# Altium schematic sheet Auxilary.SchDoc: Board Level Annotation
size 431 x 279 mm; Organization: Altium Limited; Address1: L3, 12a Rodborough Rd; Address2: Frenchs Forest; Address3: NSW; Address4: Australia 2086; DocumentNumber: 1; SheetNumber: 1; SheetTotal: 8
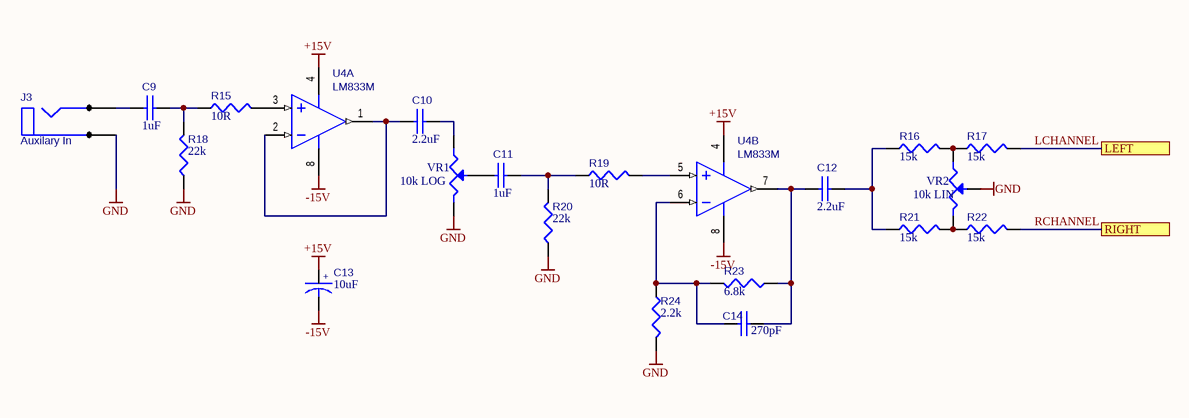
[diagram p0: Auxilary.SchDoc]

## Parts
C9  1uF  [RB.2/.4-NP]
C10  2.2uF  [RB.2/.4-NP]
C11  1uF  [RB.2/.4-NP]
C12  2.2uF  [RB.2/.4-NP]
C13  10uF  [RB.2/.4]
C14  270pF  [RAD0.2]
J3  Auxilary In  [JACK-6.25MM]
R15  10R  [AXIAL0.4]
R16  15k  [AXIAL0.4]
R17  15k  [AXIAL0.4]
R18  22k  [AXIAL0.4]
R19  10R  [AXIAL0.4]
R20  22k  [AXIAL0.4]
R21  15k  [AXIAL0.4]
R22  15k  [AXIAL0.4]
R23  6.8k  [AXIAL0.4]
R24  2.2k  [AXIAL0.4]
U4  LM833M  [DIP8]  (parts A,B of 2)
VR1  10k LOG  [POT - 24MM]
VR2  10k LIN  [POT - 24MM]

## Ports
LEFT, RIGHT

## Nets
+15V: C13.1 U4.4(V-)
-15V: C13.2 U4.8(V+)
GND: J3.3(C) R18.1 R20.1 R24.2 VR1.3 VR2.2(W)
LCHANNEL: R17.2 ; port LEFT
RCHANNEL: R22.2 ; port RIGHT
NetC9_1: C9.1 J3.1(A)
NetC9_2: C9.2 R15.1 R18.2
NetC10_1: C10.1 U4.1(OUT1) U4.2(IN1-)
NetC10_2: C10.2 VR1.1
NetC11_1: C11.1 VR1.2(W)
NetC11_2: C11.2 R19.1 R20.2
NetC12_1: C12.1 C14.2 R23.1 U4.7(OUT2)
NetC12_2: C12.2 R16.1 R21.1
NetC14_1: C14.1 R23.2 R24.1 U4.6(IN2-)
NetR15_2: R15.2 U4.3(IN1+)
NetR16_2: R16.2 R17.1 VR2.1
NetR19_2: R19.2 U4.5(IN2+)
NetR21_2: R21.2 R22.1 VR2.3

## Notes on the sheet
- 8
- 7
- 6
- 5
- 4
- 3
- DWG. NO.
- REV.
- SHT.
- 2
- 1
- THIS DOCUMENT AND THE DATA DISCLOSED HEREIN OR HEREWITH IS THE PROPERTY OF ALTIUM LIMITED AND MAY BE FREELY DISTRIBUTED IN WHOLE. NO RIGHTS ARE RESERVED OR EXPRESS OR IMPLIED WARANTEE GIVEN.
- REVISION
- DESCRIPTION
- DATE
- APPROVED
- F
- E
- D
- C
- B
- A
- TITLE
- SCALE:
- SIZE
- CAGE CODE
- FILE NAME
- DWG NO.
- SHEET
- OF
- REV
- (in symbol CAPACITOR POL) +

## Library data of the parts
C9-C12 C14 = CAP: Capacitor
  C14: Value: 270pF
C13 = CAPACITOR POL: Bi-Polar Capacitor; Value: 10uF
J3 = PHONEJACK MONO
R15-R24 = RES1: Resistor
  R15 R19: Value: 10R
  R16 R17 R21 R22: Value: 15k
  R18 R20: Value: 22k
  R23: Value: 6.8k
  R24: Value: 2.2k
U4 = LM833M: Fast Settling Dual Operational Amplifier
VR1 VR2 = POT1: Potentiometer